# Altium project MB1165.PrjPCB (part 2 of 4)

## Sheet MotorControl.SchDoc: Motor Control
size A4; DocumentNumber: MB1165; Revision: C.1; SheetNumber: 13; SheetTotal: 17; Project: STM32469I-EVAL
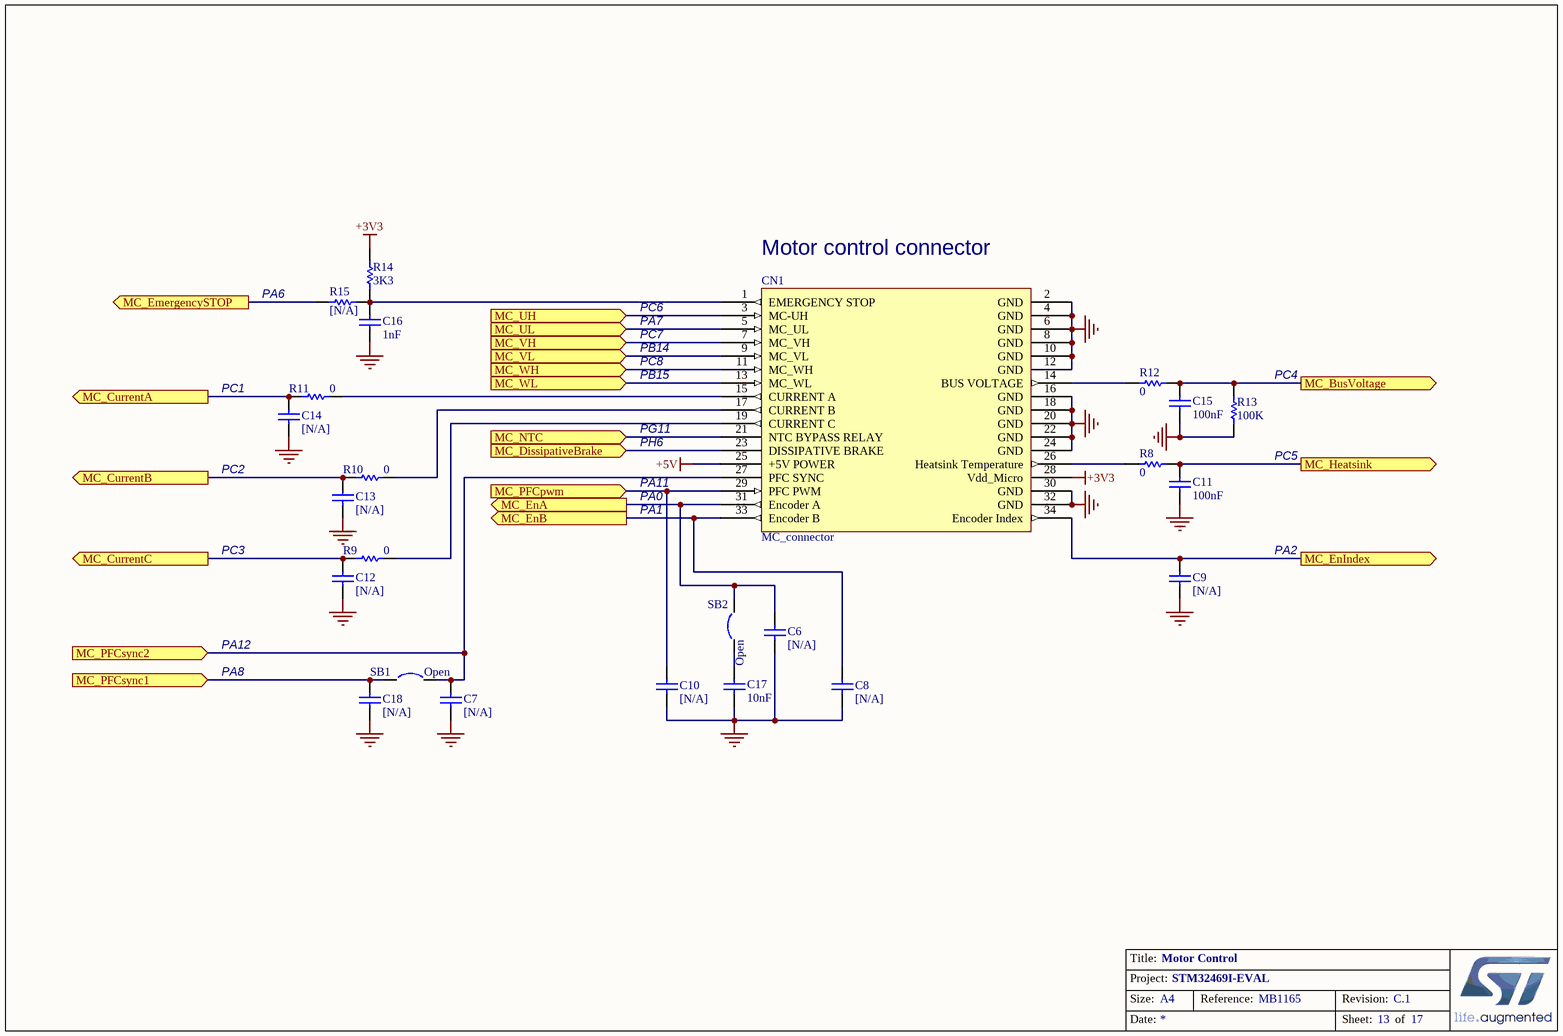
[diagram p7: MotorControl.SchDoc]

### Parts
C6  [N/A]  [0603C]
C7  [N/A]  [0603C]
C8  [N/A]  [0603C]
C9  [N/A]  [0603C]
C10  [N/A]  [0603C]
C11  100nF  [0603C]
C12  [N/A]  [0603C]
C13  [N/A]  [0603C]
C14  [N/A]  [0603C]
C15  100nF  [0603C]
C16  1nF  [0603C]
C17  10nF  [0603C]
C18  [N/A]  [0603C]
CN1  MC_connector  [IDC34S]
R8  0  [0603R]
R9  0  [0603R]
R10  0  [0603R]
R11  0  [0603R]
R12  0  [0603R]
R13  100K  [0603R]
R14  3K3  [0603R]
R15  [N/A]  [0603R]
SB1  Open  [SB_0603]
SB2  Open  [SB_0603]

### Ports
MC_BusVoltage (out), MC_CurrentA (out), MC_CurrentB (out), MC_CurrentC (out), MC_DissipativeBrake (in), MC_EmergencySTOP (out), MC_EnA (out), MC_EnB (out), MC_EnIndex (out), MC_Heatsink (out), MC_NTC (in), MC_PFCpwm (in), MC_PFCsync1 (in), MC_PFCsync2 (in), MC_UH (in), MC_UL (in), MC_VH (in), MC_VL (in), MC_WH (in), MC_WL (in)

### Nets
+3V3: CN1.28(Vdd_Micro) R14.2
+5V: CN1.25(+5V_POWER)
GND: C6.1 C7.1 C8.1 C9.1 C10.1 C11.2 C12.1 C13.1 C14.1 C15.2 C16.1 C17.2 C18.1 CN1.2(GND) CN1.4(GND) CN1.6(GND) CN1.8(GND) CN1.10(GND) CN1.12(GND) CN1.16(GND) CN1.18(GND) CN1.20(GND) CN1.22(GND) CN1.24(GND) CN1.30(GND) CN1.32(GND) R13.2
PA6: R15.2 ; port MC_EmergencySTOP
PAR_D1: CN1.7(MC_VH) ; port MC_VH
NetC6_2: C6.2 CN1.31(Encoder_A) SB2.2 ; port MC_EnA
NetC7_2: C7.2 CN1.27(PFC_SYNC) SB1.2 ; port MC_PFCsync2
NetC8_2: C8.2 CN1.33(Encoder_B) ; port MC_EnB
NetC9_2: C9.2 CN1.34(Encoder_Index) ; port MC_EnIndex
NetC10_2: C10.2 CN1.29(PFC_PWM) ; port MC_PFCpwm
NetC11_1: C11.1 R8.2 ; port MC_Heatsink
NetC12_2: C12.2 R9.1 ; port MC_CurrentC
NetC13_2: C13.2 R10.1 ; port MC_CurrentB
NetC14_2: C14.2 R11.1 ; port MC_CurrentA
NetC15_1: C15.1 R12.2 R13.1 ; port MC_BusVoltage
NetC16_2: C16.2 CN1.1(EMERGENCY_STOP) R14.1 R15.1
NetC17_1: C17.1 SB2.1
NetC18_2: C18.2 SB1.1 ; port MC_PFCsync1
NetCN1_3: CN1.3(MC-UH) ; port MC_UH
NetCN1_5: CN1.5(MC_UL) ; port MC_UL
NetCN1_9: CN1.9(MC_VL) ; port MC_VL
NetCN1_11: CN1.11(MC_WH) ; port MC_WH
NetCN1_13: CN1.13(MC_WL) ; port MC_WL
NetCN1_14: CN1.14(BUS_VOLTAGE) R12.1
NetCN1_15: CN1.15(CURRENT_A) R11.2
NetCN1_17: CN1.17(CURRENT_B) R10.2
NetCN1_19: CN1.19(CURRENT_C) R9.2
NetCN1_21: CN1.21(NTC_BYPASS_RELAY) ; port MC_NTC
NetCN1_23: CN1.23(DISSIPATIVE_BRAKE) ; port MC_DissipativeBrake
NetCN1_26: CN1.26(Heatsink_Temperature) R8.1

### Notes on the sheet
- (near R15) PA6
- PC6
- (near CN1) Motor control connector
- PA7
- PB14
- PB15
- PC7
- PC8
- (near R13) PC4
- PC1
- PG11
- PH6
- PC2
- PA1
- PA0
- PA11
- (near R13) PC5
- PC3
- PA2
- PA12
- PA8
- Title:
- Project:
- Size:
- Date:
- A4
- Reference:
- Sheet:
- Revision:
- of

### Library data of the parts
C6-C10 C12-C14 C18 = cap: Capacitor; Value: 100pF; Published: 8-Jun-2000; Revision: July-2002: Re-released for DXP Platform.; Publisher: Altium Limited
C11 C15 = Cap: Capacitor; Value: 10nF; Published: 8-Jun-2000; Revision: July-2002: Re-released for DXP Platform.; Publisher: Altium Limited
C16 C17 = CAP: Capacitor; Value: 100pF; Published: 8-Jun-2000; Revision: July-2002: Re-released for DXP Platform.; Publisher: Altium Limited
R8-R12 R14 R15 = Res1: Resistor; Value: 1K; Published: 8-Jun-2000; Revision: July-2002: Re-released for DXP Platform.; Publisher: Altium Limited
R13 = res1: Resistor; Value: 1K; Published: 8-Jun-2000; Revision: July-2002: Re-released for DXP Platform.; Publisher: Altium Limited
SB1 SB2 = Circuit Breaker: Published: 24-Mar-1999; Revision: July-2002: Re-released for DXP Platform.; Publisher: Altium Limited

## Sheet Power.SchDoc: Power
size A4; DocumentNumber: MB1165; Revision: C.1; SheetNumber: 3; SheetTotal: 17; Project: STM32469I-EVAL
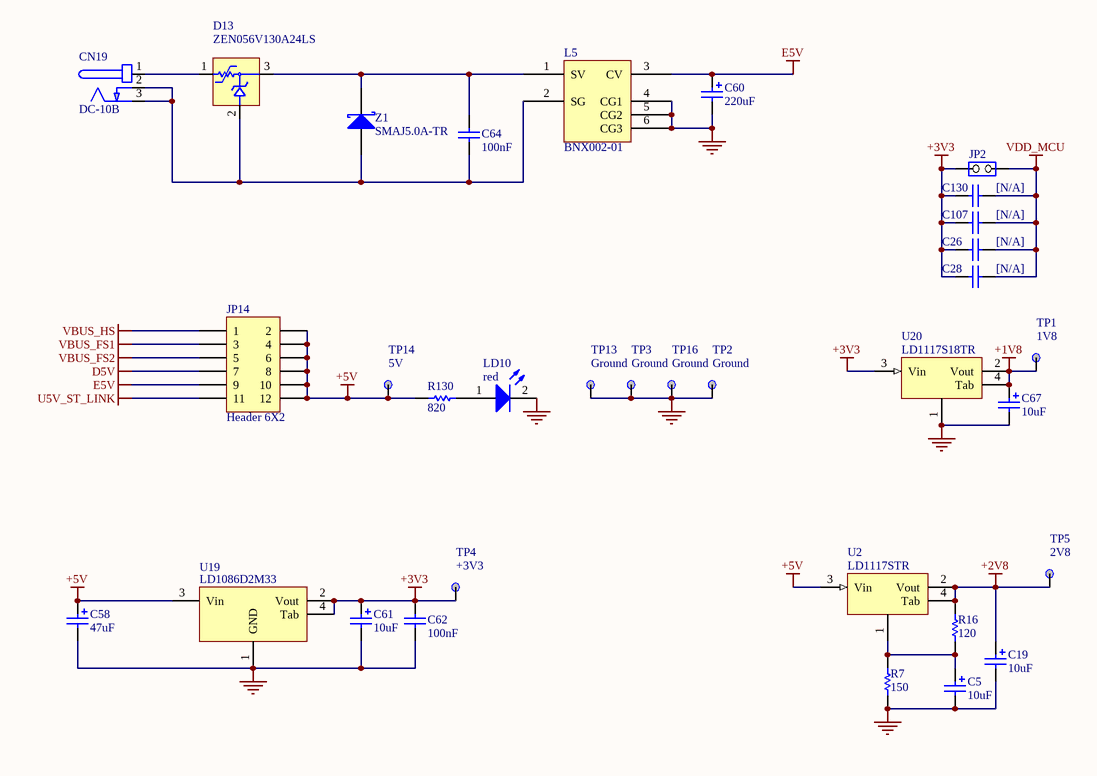
[diagram p8: Power.SchDoc]

### Parts
C5  10uF  [TAN-A]
C19  10uF  [TAN-A]
C26  [N/A]  [0603C]
C28  [N/A]  [0603C]
C58  47uF  [CAE_5R3X5R3_H5R4]
C60  220uF  [c310m-6]
C61  10uF  [TAN-A]
C62  100nF  [0603C]
C64  100nF  [0603C]
C67  10uF  [TAN-A]
C107  [N/A]  [0603C]
C130  [N/A]  [0603C]
CN19  DC-10B  [PWR_JACK_DC10]
D13  ZEN056V130A24LS  [TYCO_ZEN056V130A24LS]
JP2  (no value)  [SIP2]
JP14  Header 6X2  [HDR_2X6_2R54]
L5  BNX002-01  [BNX001]
LD10  red  [0603D]
R7  150  [0603R]
R16  120  [0603R]
R130  820  [0603R]
TP1  1V8  [TP]
TP2  Ground  [TP]
TP3  Ground  [TP]
TP4  +3V3  [TP]
TP5  2V8  [TP]
TP13  Ground  [TP]
TP14  5V  [TP]
TP16  Ground  [TP]
U2  LD1117STR  [SOT-223]
U19  LD1086D2M33  [TO263-3]
U20  LD1117S18TR  [SOT-223]
Z1  SMAJ5.0A-TR  [sma]

### Nets
+1V8: C67.1 TP1.1 U20.2(Vout) U20.4(Tab)
+2V8: C19.1 R16.1 TP5.1 U2.2(Vout) U2.4(Tab)
+3V3: C26.1 C28.1 C61.1 C62.1 C107.1 C130.1 JP2.1(COMMON) TP4.1 U19.2(Vout) U19.4(Tab) U20.3(Vin)
+5V: C58.1 JP14.2 JP14.4 JP14.6 JP14.8 JP14.10 JP14.12 R130.2 TP14.1 U2.3(Vin) U19.3(Vin)
D5V: JP14.7
E5V: C60.1 JP14.9 L5.3(CV)
GND: C5.2 C19.2 C58.2 C60.2 C61.2 C62.2 C67.2 L5.4(CG1) L5.5(CG2) L5.6(CG3) LD10.2(K) R7.2 TP2.1 TP3.1 TP13.1 TP16.1 U19.1(GND) U20.1
U5V_ST_LINK: JP14.11
VBUS_FS1: JP14.3
VBUS_FS2: JP14.5
VBUS_HS: JP14.1
VDD_MCU: C26.2 C28.2 C107.2 C130.2 JP2.2(NO)
NetC5_1: C5.1 R7.1 R16.2 U2.1
NetC64_1: C64.1 D13.3 L5.1(SV) Z1.2(K)
NetC64_2: C64.2 CN19.2(GND) CN19.3(GND) D13.2 L5.2(SG) Z1.1(A)
NetCN19_1: CN19.1(+) D13.1
NetLD10_1: LD10.1(A) R130.1

### Notes on the sheet
- Title:
- Project:
- Size:
- Date:
- A4
- Reference:
- Sheet:
- Revision:
- of

### Library data of the parts
C5 C19 C61 C67 = Cap Pol1: Polarized Capacitor (Radial); Published: 8-Jun-2000; Revision: July-2002: Re-released for DXP Platform.; Publisher: Altium Limited; Value: 10uF
C26 C28 C62 C107 C130 = Cap: Capacitor; Value: 10nF; Published: 8-Jun-2000; Revision: July-2002: Re-released for DXP Platform.; Publisher: Altium Limited
C58 = Cap Pol1: Polarized Capacitor (Radial); Value: 10uF; Published: 8-Jun-2000; Revision: July-2002: Re-released for DXP Platform.; Publisher: Altium Limited
C60 = Cap Pol1: Polarized Capacitor (Radial); Value: 47uF; Published: 8-Jun-2000; Revision: July-2002: Re-released for DXP Platform.; Publisher: Altium Limited
C64 = CAP: Capacitor; Value: 100pF; Published: 8-Jun-2000; Revision: July-2002: Re-released for DXP Platform.; Publisher: Altium Limited
CN19 = PJ202A
JP2 = JP2
JP14 = Header 6X2: Header, 6-Pin, Dual row; Revision: 17-Jul-2002: Re-released for DXP Platform.; Publisher: Altium Limited
L5 = BNX002
LD10 = LED2: Typical RED, GREEN, YELLOW, AMBER GaAs LED; Published: 8-Jun-2000; Revision: July-2002: Re-released for DXP Platform.; Publisher: Altium Limited
R7 R16 R130 = res1: Resistor; Value: 1K; Published: 8-Jun-2000; Revision: July-2002: Re-released for DXP Platform.; Publisher: Altium Limited
TP1-TP5 TP13 TP14 TP16 = TP
U2 U20 = LD1117
U19 = VOLTREG1
Z1 = D Schottky: Schottky Diode; Code - JEDEC: DO-214-AA; Published: 8-Jun-2000; Revision: July-2002: Re-released for DXP Platform.; Publisher: Altium Limited

## Sheet RS232&IrDA.SchDoc: RS232 & IrDA
size A4; DocumentNumber: MB1165; Revision: C.1; SheetNumber: 10; SheetTotal: 17; Project: STM32469I-EVAL
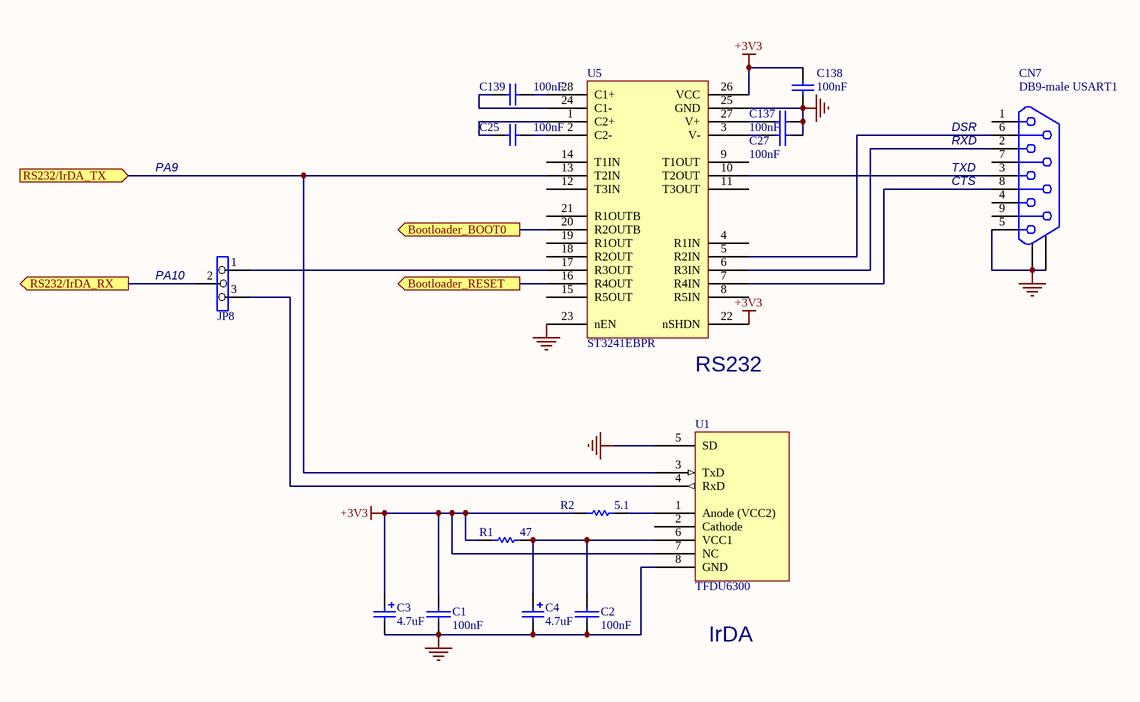
[diagram p9: RS232&IrDA.SchDoc]

### Parts
C1  100nF  [0603C]
C2  100nF  [0603C]
C3  4.7uF  [TAN-A]
C4  4.7uF  [TAN-A]
C25  100nF  [0603C]
C27  100nF  [0603C]
C137  100nF  [0603C]
C138  100nF  [0603C]
C139  100nF  [0603C]
CN7  DB9-male USART1  [DB9/M]
JP8  (no value)  [SIP3]
R1  47  [0603R]
R2  5.1  [0603R]
U1  TFDU6300  [IR_VISHAY3]
U5  ST3241EBPR  [SSOP28_0R65_10R2X7R8]

### Ports
Bootloader_BOOT0 (out), Bootloader_RESET (out), RS232/IrDA_RX (out), RS232/IrDA_TX (in)

### Nets
+3V3: C1.1 C3.1 C138.1 R1.1 R2.1 U1.7(NC) U5.22(nSHDN) U5.26(VCC)
GND: C1.2 C2.2 C3.2 C4.2 C27.1 C137.1 C138.2 CN7.5 CN7.10 CN7.11 U1.5(SD) U1.8(GND) U5.23(nEN) U5.25(GND)
NetC2_1: C2.1 C4.1 R1.2 U1.6(VCC1)
NetC25_1: C25.1 U5.1(C2+)
NetC25_2: C25.2 U5.2(C2-)
NetC27_2: C27.2 U5.3(V-)
NetC137_2: C137.2 U5.27(V+)
NetC139_1: C139.1 U5.24(C1-)
NetC139_2: C139.2 U5.28(C1+)
NetCN7_2: CN7.2 U5.6(R3IN)
NetCN7_3: CN7.3 U5.10(T2OUT)
NetCN7_6: CN7.6 U5.5(R2IN)
NetCN7_8: CN7.8 U5.7(R4IN)
NetD1_1: U5.20(R2OUTB) ; port Bootloader_BOOT0
NetJP4_2: U5.16(R4OUT) ; port Bootloader_RESET
NetJP8_1: JP8.1 U5.17(R3OUT)
NetJP8_2: JP8.2 ; port RS232/IrDA_RX
NetJP8_3: JP8.3 U1.4(RxD)
NetJP19_1: U1.3(TxD) U5.13(T2IN) ; port RS232/IrDA_TX
NetR2_2: R2.2 U1.1(Anode_(VCC2))

Not connected (* = marked no-connect by the designer): CN7 1 4 7 9; U1 2(Cathode); U5 4(R1IN) 8(R5IN) 9(T1OUT) 11(T3OUT) 12(T3IN) 14(T1IN) 15(R5OUT) 18(R2OUT) 19(R1OUT) 21(R1OUTB)

### Notes on the sheet
- PA9
- (near CN7) RXD
- (near CN7) TXD
- (near CN7) DSR
- (near CN7) CTS
- (near JP8) PA10
- (near U5) RS232
- IrDA
- Title:
- Project:
- Size:
- Date:
- A4
- Reference:
- Sheet:
- Revision:
- of

### Library data of the parts
C1 C2 = CAP: Capacitor
C3 C4 = Cap Pol1: Polarized Capacitor (Radial); Value: 100pF; Published: 8-Jun-2000; Revision: July-2002: Re-released for DXP Platform.; Publisher: Altium Limited
C25 C27 C137-C139 = Cap: Capacitor; Value: 10nF; Published: 8-Jun-2000; Revision: July-2002: Re-released for DXP Platform.; Publisher: Altium Limited
CN7 = DB9-USART
JP8 = Jumper3
R1 R2 = Res1: Resistor; Value: 1K; Published: 8-Jun-2000; Revision: July-2002: Re-released for DXP Platform.; Publisher: Altium Limited
U1 = TFDU4300
U5 = ST3241

## Sheet ST_LINK_V2-1.SCHDOC: ST-LINK/V2-1
size A4; DocumentNumber: MB1165; Revision: C.1; SheetNumber: 15; SheetTotal: 17; Project: STM32469I-EVAL
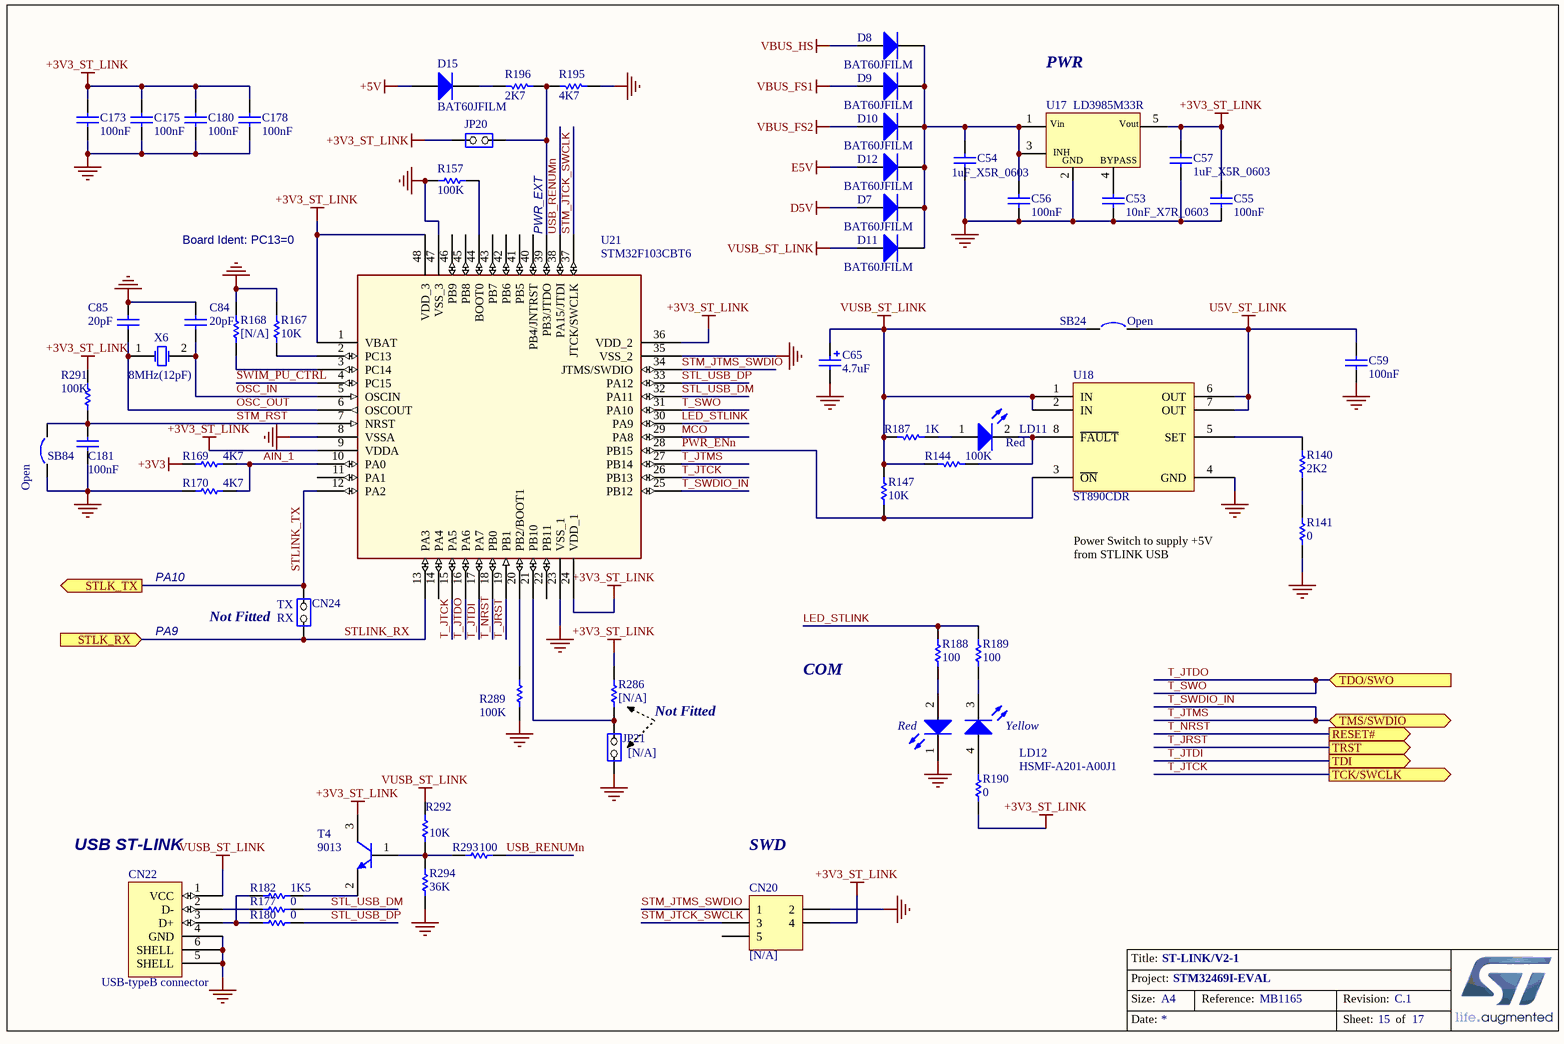
[diagram p10: ST_LINK_V2-1.SCHDOC]

### Parts
C53  10nF_X7R_0603  [0603C]
C54  1uF_X5R_0603  [0603C]
C55  100nF  [0603C]
C56  100nF  [0603C]
C57  1uF_X5R_0603  [0603C]
C59  100nF  [0603C]
C65  4.7uF  [TAN-A]
C84  20pF  [0603C]
C85  20pF  [0603C]
C173  100nF  [0603C]
C175  100nF  [0603C]
C178  100nF  [0603C]
C180  100nF  [0603C]
C181  100nF  [0603C]
CN20  [N/A]  [HDR_2X3-1_2R54-6]
CN22  USB-typeB connector  [USB-B]
CN24  (no value)  [SIP2]
D7  BAT60JFILM  [SOD-323]
D8  BAT60JFILM  [SOD-323]
D9  BAT60JFILM  [SOD-323]
D10  BAT60JFILM  [SOD-323]
D11  BAT60JFILM  [SOD-323]
D12  BAT60JFILM  [SOD-323]
D15  BAT60JFILM  [SOD-323]
JP20  (no value)  [SIP2]
JP21  [N/A]  [SIP2]
LD11  Red  [0603D]
LD12  HSMF-A201-A00J1  [LED2_3528]
R140  2K2  [0402R]
R141  0  [0603R]
R144  100K  [0603R]
R147  10K  [0402R]
R157  100K  [0603R]
R167  10K  [0603R]
R168  [N/A]  [0603R]
R169  4K7  [0603R]
R170  4K7  [0603R]
R177  0  [0603R]
R180  0  [0603R]
R182  1K5  [0603R]
R187  1K  [0603R]
R188  100  [0603R]
R189  100  [0603R]
R190  0  [0603R]
R195  4K7  [0603R]
R196  2K7  [0603R]
R286  [N/A]  [0603R]
R289  100K  [0603R]
R291  100K  [0603R]
R292  10K  [0603R]
R293  100  [0603R]
R294  36K  [0603R]
SB24  Open  [SB_0603]
SB84  Open  [SB_0603]
T4  9013  [SOT-23]
U17  LD3985M33R  [SOT23-5]
U18  ST890CDR  [SOIC8_1R27_4R9X6]
U21  STM32F103CBT6  [LQFP48_0R5_9X9]
X6  8MHz(12pF)  [XTAL_2SM_12R7X4R7]

### Ports
RESET# (out), STLK_RX (in), STLK_TX (out), TCK/SWCLK (out), TDI (out), TDO/SWO (in), TMS/SWDIO (bidir), TRST (out)

### Nets
+3V3: R169.1
+3V3_ST_LINK: C55.2 C57.1 C173.2 C175.2 C178.2 C180.2 CN20.4 JP20.1(COMMON) R190.2 R286.1 R291.2 T4.3(C) U17.5(Vout) U21.1(VBAT) U21.9(VDDA) U21.24(VDD_1) U21.36(VDD_2) U21.48(VDD_3)
+5V: D15.1(A)
D5V: D7.1(A)
E5V: D12.1(A)
GND: C53.1 C54.1 C55.1 C56.1 C57.2 C59.1 C65.2 C84.2 C85.2 C173.1 C175.1 C178.1 C180.1 C181.1 CN20.2 CN22.4(GND) CN22.5(SHELL) CN22.6(SHELL) JP21.1(COMMON) LD12.1(RED_cathode) R141.1 R157.1 R167.1 R168.1 R170.1 R195.2 R289.1 R294.1 SB84.1 U17.2(GND) U18.4(GND) U21.8(VSSA) U21.23(VSS_1) U21.35(VSS_2) U21.47(VSS_3)
U5V_ST_LINK: C59.2 SB24.2 U18.6(OUT) U18.7(OUT)
VBUS_FS1: D9.1(A)
VBUS_FS2: D10.1(A)
VBUS_HS: D8.1(A)
VUSB_ST_LINK: C65.1 CN22.1(VCC) D11.1(A) R144.1 R147.1 R187.1 R292.2 SB24.1 U18.1(IN) U18.2(IN)
AIN_1: R169.2 R170.2 U21.10(PA0)
LED_STLINK: R188.1 R189.1 U21.30(PA9)
MCO: U21.29(PA8)
OSC_IN: C84.1 U21.5(OSCIN) X6.2(OSC2)
OSC_OUT: C85.1 U21.6(OSCOUT) X6.1(OSC1)
PWR_ENn: R147.2 U18.3(~{ON}) U21.28(PB15)
STL_USB_DM: R177.2 U21.32(PA11)
STL_USB_DP: R180.2 U21.33(PA12)
STLINK_RX: CN24.1(COMMON) U21.13(PA3) ; port STLK_RX
STLINK_TX: CN24.2(NO) U21.12(PA2) ; port STLK_TX
STM_JTCK_SWCLK: CN20.3 U21.37(JTCK/SWCLK)
STM_JTMS_SWDIO: CN20.1 U21.34(JTMS/SWDIO)
STM_RST: C181.2 R291.1 SB84.2 U21.7(NRST)
SWIM_PU_CTRL: U21.4(PC15)
T_JRST: U21.19(PB1) ; port TRST  [project net PB4]
T_JTCK: U21.15(PA5) U21.26(PB13) ; port TCK/SWCLK  [project net PA14]
T_JTDI: U21.17(PA7) ; port TDI  [project net PA15]
T_JTDO: U21.16(PA6) U21.31(PA10) ; port TDO/SWO  [also labelled T_SWO]
T_JTMS: U21.25(PB12) U21.27(PB14) ; port TMS/SWDIO  [also labelled T_SWDIO_IN]  [project net PA13]
T_NRST: U21.18(PB0) ; port RESET#  [project net RESET#]
USB_RENUMn: R293.2 U21.38(PA15/JTDI)
NetC53_2: C53.2 U17.4(BYPASS)
NetC54_2: C54.2 C56.2 D7.2(K) D8.2(K) D9.2(K) D10.2(K) D11.2(K) D12.2(K) U17.1(Vin) U17.3(CE)
NetCN22_2: CN22.2(D-) R177.1
NetCN22_3: CN22.3(D+) R180.1 R182.1
NetD15_2: D15.2(K) R196.1
NetJP20_2: JP20.2(NO) R195.1 R196.2 U21.39(PB3/JTDO)
NetJP21_2: JP21.2(NO) R286.2 U21.21(PB10)
NetLD11_1: LD11.1(A) R187.2
NetLD11_2: LD11.2(K) R144.2 U18.8(~{FAULT})
NetLD12_2: LD12.2(Red_anode) R188.2
NetLD12_3: LD12.3(YellowGreen_cathode) R189.2
NetLD12_4: LD12.4(YellowGreen_anode) R190.1
NetR140_1: R140.1 R141.2
NetR140_2: R140.2 U18.5(SET)
NetR157_2: R157.2 U21.44(BOOT0)
NetR167_2: R167.2 U21.2(PC13)
NetR168_2: R168.2 U21.3(PC14)
NetR182_2: R182.2 T4.2(E)
NetR289_2: R289.2 U21.20(PB2/BOOT1)
NetR292_1: R292.1 R293.1 R294.2 T4.1(B)

Not connected (* = marked no-connect by the designer): CN20 5; U21 11(PA1) 14(PA4) 22(PB11) 40(PB4/JNTRST) 41(PB5) 42(PB6) 43(PB7) 45(PB8) 46(PB9)

### Notes on the sheet
- PWR
- Board Ident: PC13=0
- (near U21) PWR_EXT
- PA10
- Power Switch to supply +5V from STLINK USB
- PA9
- (near CN24) Not Fitted
- (near CN24) TX
- (near CN24) RX
- Not Fitted
- COM
- (near CN22) USB ST-LINK
- SWD
- Title:
- Project:
- Size:
- Date:
- A4
- Reference:
- Sheet:
- Revision:
- of
- (in symbol HSMF-A201-A00J1) Red; Yellow
- (in symbol LD3985M33R) INH

### Library data of the parts
C53 = CAP SMD 0603  X7R 10000PF 50V 10%: 0603  X7R 10NF; Order code RS: 2040779; Rated voltage: 50V; Tolerance: 10%; Order code Farnell: 7569548RL; Value: 10NF; Power: *; Technology: X7R; Temperature Factor: *; Temperature Min: -55°C; Temperature Max: +125°C; STS Code: *
C54 C57 = CAP SMD 0603  X5R 1µF 25V 10%: 0603  X5R 1µF; Rated voltage: 25V; Tolerance: 10%; Manufacturer: *; Manufacturer P/N: *; Order code Farnell: 1288202RL; Value: 1µF; Power: *; Technology: X5R; Temperature  Factor: *; Temperature Max: +125°C; Temperature Min: -55°C; STS Code: *
C55 C56 C59 C173 C175 C178 C180 C181 = Capacitor_ST: Capacitor 0402 / 0603 / 0805; Revision: July-2002: Re-released for DXP Platform.; Value: 100nF
C65 = Cap Pol1: Polarized Capacitor (Radial); Value: 100pF; Ordered by: Subcon; Published: 8-Jun-2000; Revision: July-2002: Re-released for DXP Platform.; Publisher: Altium Limited
C84 C85 = Capacitor_ST: Capacitor 0402 / 0603 / 0805; Value: 100nF; Revision: July-2002: Re-released for DXP Platform.
CN20 = Header 3X2: Header, 3-Pin, Dual row; Revision: 17-Jul-2002: Re-released for DXP Platform.; Publisher: Altium Limited
CN24 = JP2: Fitted: NO
D7-D12 = BAT60JFILM: Manuf_1: STM; Provided: ST; ECCN_US/EU: EAR99/NEC; Revision: July-2002: Re-released for DXP Platform.; Order: BAT60JFILM; Manuf_Part_1: BAT60JFILM; Distrib: ST
D15 = Diode: Default Diode; Code - JEDEC: DO-214-AB; Ordered by: STM; ECCN_US/EU: EAR99/NEC; Published: 8-Jun-2000; Revision: July-2002: Re-released for DXP Platform.; Publisher: Altium Limited
JP20 = JP2: Ordered by: Subcon; Silkscreen: Pwr_ext
JP21 = JP2
LD11 = LED2: Typical RED, GREEN, YELLOW, AMBER GaAs LED; Published: 8-Jun-2000; Revision: July-2002: Re-released for DXP Platform.; Publisher: Altium Limited
R140 R157 R177 R180 R182 R289 R291 R293 = Resistor_ST: Resistor 0402 / 0603 / 0805; Description: Resistor 0402 or 0603 or 0805; Value: 10K
R141 R188-R190 R195 R196 R286 R292 R294 = Res1: Resistor; Value: 1K; Published: 8-Jun-2000; Revision: July-2002: Re-released for DXP Platform.; Publisher: Altium Limited
R144 = Res1: Resistor; Value: 1K; Ordered by: Subcon; Published: 8-Jun-2000; Revision: July-2002: Re-released for DXP Platform.; Publisher: Altium Limited
R147 R167 = Resistor_ST: Resistor 0402 / 0603 / 0805; Description: Resistor 0402 or 0603 or 0805; Value: 10K
R168-R170 = Resistor_ST: Resistor 0402 / 0603 / 0805; Description: Resistor 0402 or 0603 or 0805; Value: 10K; Fitted: NO
R187 = Res1: Resistor; Ordered by: Subcon; Published: 8-Jun-2000; Revision: July-2002: Re-released for DXP Platform.; Publisher: Altium Limited; Value: 1K
SB24 SB84 = Circuit Breaker: Published: 24-Mar-1999; Revision: July-2002: Re-released for DXP Platform.; Publisher: Altium Limited
T4 = NPN: NPN Bipolar Transistor; Code - JEDEC: TO-226-AA; Published: 8-Jun-2000; Revision: July-2002: Re-released for DXP Platform.; Publisher: Altium Limited
U17 = LD3985M33R: Ultra low drop-low noise BiCMOS voltage, regulators low ESR capacitors compatible; Manuf_1: STM; Provided: ST; Ref St: 9176161; ECCN_US/EU: EAR99/NEC; Manuf_Part_1: LD3985M33R; Distrib: ST; Order: LD3985M33R
U21 = STM32F103CBT6: Medium-density performance line ARM-based 32-bit MCU with 64KB Flash; Manuf_Part_1: STM32F103C8T6; Manuf_1: STM; Ref St: 9175981; Provided: ST; ECCN_US/EU: 3A991A2/NEC; Footprint: QFP48 7X7; Distrib: ST; Order: STM32F103C8T6
X6 = XTAL: Crystal Oscillator; Published: 8-Jun-2000; LatestRevisionDate: 17-Jul-2002; LatestRevisionNote: Re-released for DXP Platform.; PackageReference: R38; Publisher: Altium Limited

## Sheet USB_OTG.SchDoc: USB_OTG_HS
size A4; DocumentNumber: MB1165; Revision: C.1; SheetNumber: 8; SheetTotal: 17; Project: STM32469I-EVAL
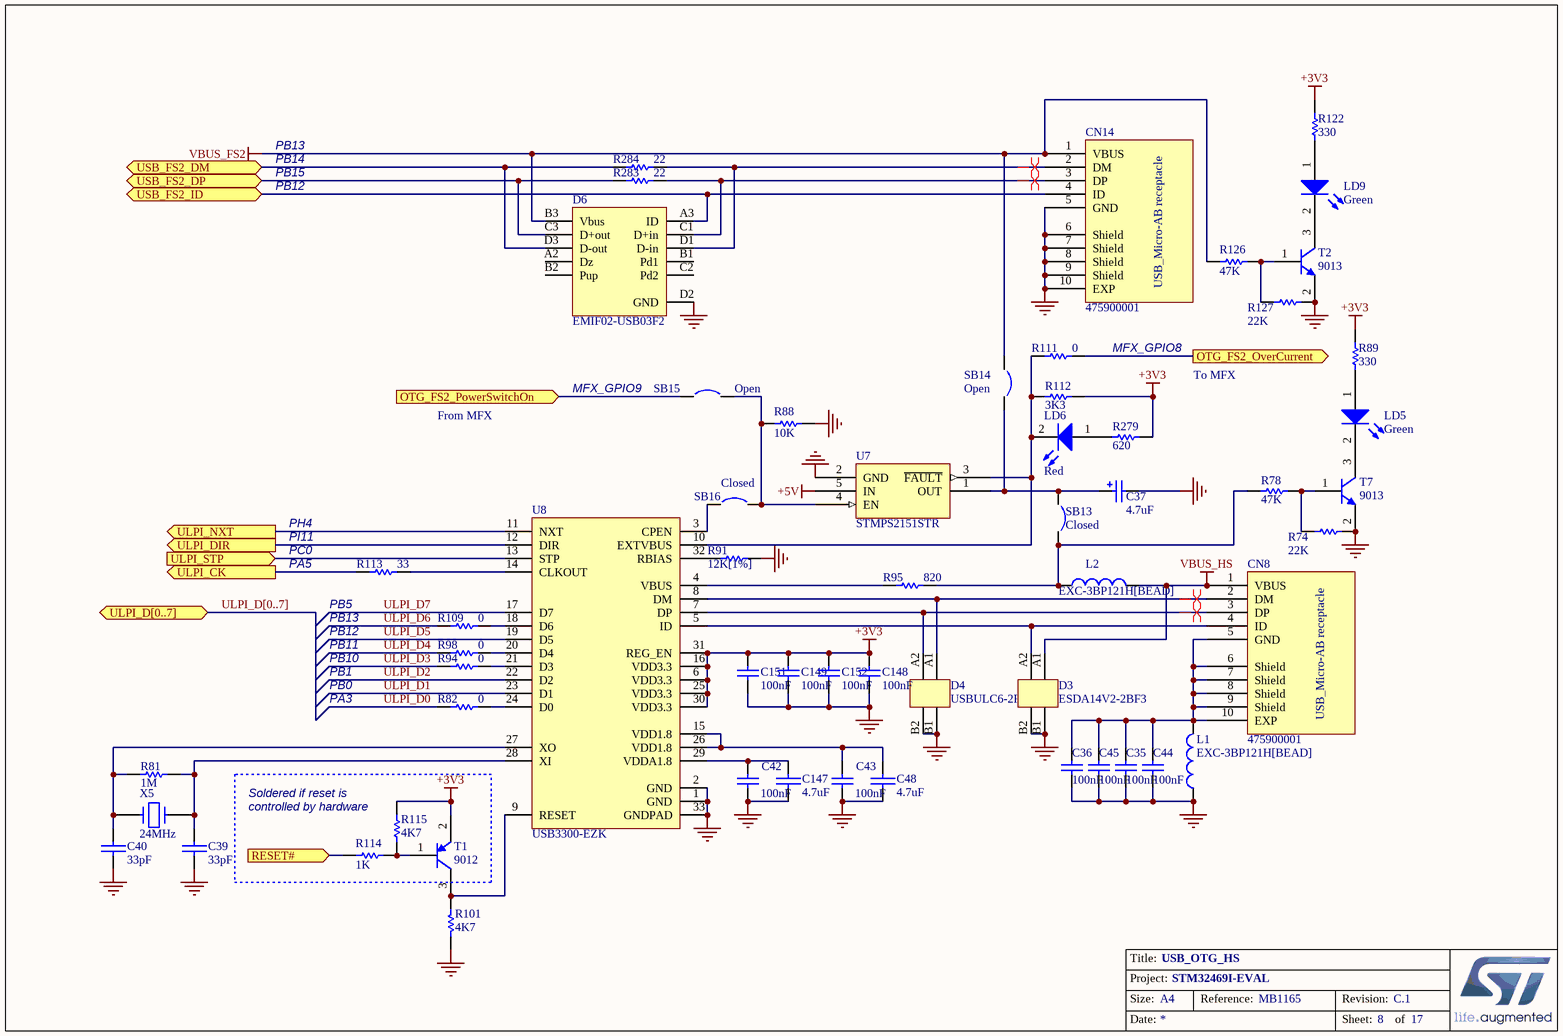
[diagram p11: USB_OTG.SchDoc]

### Parts
C35  100nF  [0603C]
C36  100nF  [0603C]
C37  4.7uF  [TAN-A]
C39  33pF  [0603C]
C40  33pF  [0603C]
C42  100nF  [0603C]
C43  100nF  [0603C]
C44  100nF  [0603C]
C45  100nF  [0603C]
C48  4.7uF  [TAN-A]
C147  4.7uF  [TAN-A]
C148  100nF  [0603C]
C149  100nF  [0603C]
C151  100nF  [0603C]
C152  100nF  [0603C]
CN8  475900001  [MOLEX_47590001]
CN14  475900001  [MOLEX_47590001]
D3  ESDA14V2-2BF3  [BGA4_0R4_0R8X0R8]
D4  USBULC6-2F3  [BGA4_0R4_1X1]
D6  EMIF02-USB03F2  [BGA11_0R5_1R57X2R07]
L1  EXC-3BP121H[BEAD]  [0603L]
L2  EXC-3BP121H[BEAD]  [0603L]
LD5  Green  [0603D]
LD6  Red  [0603D]
LD9  Green  [0603D]
R74  22K  [0603R]
R78  47K  [0603R]
R81  1M  [0603R]
R82  0  [0603R]
R88  10K  [0603R]
R89  330  [0603R]
R91  12K[1%]  [0603R]
R94  0  [0603R]
R95  820  [0603R]
R98  0  [0603R]
R101  4K7  [0603R]
R109  0  [0603R]
R111  0  [0603R]
R112  3K3  [0603R]
R113  33  [0603R]
R114  1K  [0603R]
R115  4K7  [0603R]
R122  330  [0603R]
R126  47K  [0603R]
R127  22K  [0603R]
R279  620  [0603R]
R283  22  [0603R]
R284  22  [0603R]
SB13  Closed  [SB_0603]
SB14  Open  [SB_0603]
SB15  Open  [SB_0603]
SB16  Closed  [SB_0603]
T1  9012  [SOT-23]
T2  9013  [SOT-23]
T7  9013  [SOT-23]
U7  STMPS2151STR  [SOT23-5]
U8  USB3300-EZK  [QFN32_0R5_5X5]
X5  24MHz  [XTAL1]

### Ports
OTG_FS2_OverCurrent (out), OTG_FS2_PowerSwitchOn (in), RESET# (in), ULPI_CK (out), ULPI_D[0..7] (bidir), ULPI_DIR (out), ULPI_NXT (out), ULPI_STP (in), USB_FS2_DM (bidir), USB_FS2_DP (bidir), USB_FS2_ID (bidir)

### Nets
+3V3: C148.1 C149.1 C151.1 C152.1 R89.2 R112.1 R115.1 R122.2 R279.2 T1.2(E) U8.6(VDD3.3) U8.16(VDD3.3) U8.25(VDD3.3) U8.30(VDD3.3) U8.31(REG_EN)
+5V: U7.5(IN)
GND: C35.2 C36.2 C37.2 C39.2 C40.2 C42.2 C43.2 C44.2 C45.2 C48.2 C147.2 C148.2 C149.2 C151.2 C152.2 CN14.5(GND) CN14.6(Shield) CN14.7(Shield) CN14.8(Shield) CN14.9(Shield) CN14.10(EXP) D3.B1 D3.B2 D4.B1 D4.B2 D6.D2(GND) L1.1 R74.1 R88.1 R91.1 R101.1 R127.1 T2.2(E) T7.2(E) U7.2(GND) U8.1(GND) U8.2(GND) U8.33(GNDPAD)
VBUS_FS2: CN14.1(VBUS) D6.B3(Vbus) R126.1 SB14.1
VBUS_HS: CN8.1(VBUS) D3.A1 L2.2
PA5: R113.2 ; port ULPI_CK
RESET#: R114.2 ; port RESET#
ULPI_D0: R82.2  [project net PA3]
ULPI_D1: U8.23(D1)
ULPI_D2: U8.22(D2)
ULPI_D3: R94.2  [project net PB10]
ULPI_D4: R98.2  [project net PB11]
ULPI_D5: U8.19(D5)
ULPI_D6: R109.2  [project net PB13]
ULPI_D7: U8.17(D7)
NetC35_1: C35.1 C36.1 C44.1 C45.1 CN8.5(GND) CN8.6(Shield) CN8.7(Shield) CN8.8(Shield) CN8.9(Shield) CN8.10(EXP) L1.2
NetC37_1: C37.1 SB13.1 SB14.2 U7.1(OUT)
NetC39_1: C39.1 R81.2 U8.28(XI) X5.1
NetC40_1: C40.1 R81.1 U8.27(XO) X5.2
NetC42_1: C42.1 C147.1 U8.29(VDDA1.8)
NetC43_1: C43.1 C48.1 U8.15(VDD1.8) U8.26(VDD1.8)
NetCN8_2: CN8.2(DM) D4.A1 U8.8(DM)
NetCN8_3: CN8.3(DP) D4.A2 U8.7(DP)
NetCN8_4: CN8.4(ID) D3.A2 U8.5(ID)
NetCN14_2: CN14.2(DM) D6.D1(D-in) R284.1
NetCN14_3: CN14.3(DP) D6.C1(D+in) R283.1
NetCN14_4: CN14.4(ID) D6.A3(ID) ; port USB_FS2_ID
NetD6_C3: D6.C3(D+out) R283.2 ; port USB_FS2_DP
NetD6_D3: D6.D3(D-out) R284.2 ; port USB_FS2_DM
NetL2_1: L2.1 R78.2 R95.2 SB13.2
NetLD5_1: LD5.1(A) R89.1
NetLD5_2: LD5.2(K) T7.3(C)
NetLD6_1: LD6.1(A) R279.1
NetLD6_2: LD6.2(K) R111.2 R112.2 U7.3(~{FAULT}) U8.10(EXTVBUS)
NetLD9_1: LD9.1(A) R122.1
NetLD9_2: LD9.2(K) T2.3(C)
NetR74_2: R74.2 R78.1 T7.1(B)
NetR82_1: R82.1 U8.24(D0)
NetR88_2: R88.2 SB15.2 SB16.2 U7.4(EN)
NetR91_2: R91.2 U8.32(RBIAS)
NetR94_1: R94.1 U8.21(D3)
NetR95_1: R95.1 U8.4(VBUS)
NetR98_1: R98.1 U8.20(D4)
NetR101_2: R101.2 T1.3(C) U8.9(RESET)
NetR109_1: R109.1 U8.18(D6)
NetR111_1: R111.1 ; port OTG_FS2_OverCurrent
NetR113_1: R113.1 U8.14(CLKOUT)
NetR114_1: R114.1 R115.2 T1.1(B)
NetR126_2: R126.2 R127.2 T2.1(B)
NetSB15_1: SB15.1 ; port OTG_FS2_PowerSwitchOn
NetSB16_1: SB16.1 U8.3(CPEN)
NetSB32_2: U8.12(DIR) ; port ULPI_DIR
NetSB34_2: U8.13(STP) ; port ULPI_STP
NetSB56_2: U8.11(NXT) ; port ULPI_NXT

Not connected (* = marked no-connect by the designer): D6 A2(Dz) B1(Pd1) B2(Pup) C2(Pd2)

### Buses and harness runs
bus ULPI_D[0..7] = port ULPI_D[0..7]

### Layout directives
differential pair: NetCN8_2, NetCN8_3, NetCN14_2, NetCN14_3

### Notes on the sheet
- PB13
- PB14
- PB15
- PB12
- MFX_GPIO8
- To MFX
- From MFX
- MFX_GPIO9
- PH4
- PI11
- PC0
- PA5
- PB11
- (near R113) PB13
- (near R113) PB5
- PA3
- PB0
- PB1
- PB10
- (near R115) Soldered if reset is
- (near R115) controlled by hardware
- Title:
- Project:
- Size:
- Date:
- A4
- Reference:
- Sheet:
- Revision:
- of
- (in symbol 475900001) USB_Micro-AB receptacle

### Library data of the parts
C35 C36 C42-C45 C148 C149 C151 C152 = Cap: Capacitor; Value: 10nF; Published: 8-Jun-2000; Revision: July-2002: Re-released for DXP Platform.; Publisher: Altium Limited
C37 = Cap Pol1: Polarized Capacitor (Radial); Value: 47uF; Published: 8-Jun-2000; Revision: July-2002: Re-released for DXP Platform.; Publisher: Altium Limited
C39 C40 C48 C147 = CAP: Capacitor
L1 L2 = Inductor: Value: 100uH; Published: 8-Jun-2000; Revision: July-2002: Re-released for DXP Platform.; Publisher: Altium Limited
LD5 LD6 LD9 = LED2: as LD11 on sheet ST_LINK_V2-1; Published: 8-Jun-2000; Revision: July-2002: Re-released for DXP Platform.; Publisher: Altium Limited
R74 R78 R88 R89 R95 R112 R122 R126 R127 = res1: Resistor; Value: 1K; Published: 8-Jun-2000; Revision: July-2002: Re-released for DXP Platform.; Publisher: Altium Limited
R81 R82 R91 R94 R98 R101 R109 R111 R113 R115 R279 R283 R284 = Res1: Resistor; Value: 1K; Published: 8-Jun-2000; Revision: July-2002: Re-released for DXP Platform.; Publisher: Altium Limited
R114 = Res1: Resistor; Published: 8-Jun-2000; Revision: July-2002: Re-released for DXP Platform.; Publisher: Altium Limited; Value: 1K
SB13 SB16 = Circuit Breaker_close: Circuit Breaker; Published: 24-Mar-1999; Revision: July-2002: Re-released for DXP Platform.; Publisher: Altium Limited
SB14 SB15 = Circuit Breaker: Published: 24-Mar-1999; Revision: July-2002: Re-released for DXP Platform.; Publisher: Altium Limited
T1 = PNP: PNP Bipolar Transistor; Published: 8-Jun-2000; Revision: July-2002: Re-released for DXP Platform.; Publisher: Altium Limited; Code - JEDEC: SOT-23
T2 T7 = NPN: as T4 on sheet ST_LINK_V2-1; Published: 8-Jun-2000; Revision: July-2002: Re-released for DXP Platform.; Publisher: Altium Limited
U7 = STMPS2141STR
X5 = CRYSTAL

## Sheet USB_OTG_FS.SchDoc: USB_OTG_FS
size A4; DocumentNumber: MB1165; Revision: C.1; SheetNumber: 9; SheetTotal: 17; Project: STM32469I-EVAL
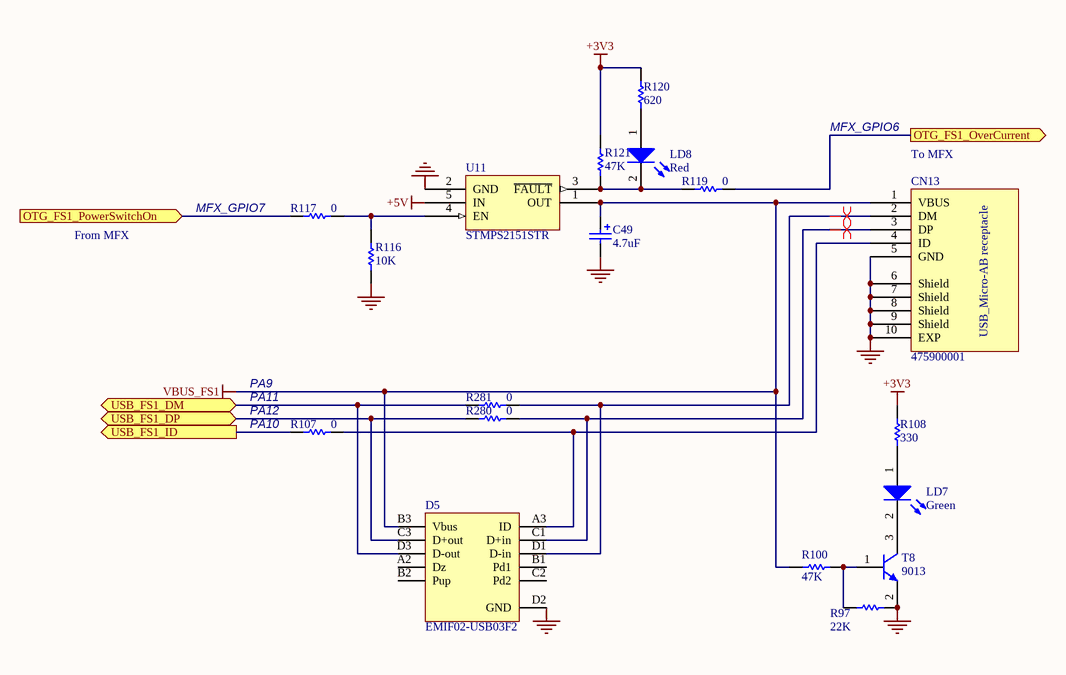
[diagram p12: USB_OTG_FS.SchDoc]

### Parts
C49  4.7uF  [TAN-A]
CN13  475900001  [MOLEX_47590001]
D5  EMIF02-USB03F2  [BGA11_0R5_1R57X2R07]
LD7  Green  [0603D]
LD8  Red  [0603D]
R97  22K  [0603R]
R100  47K  [0603R]
R107  0  [0603R]
R108  330  [0603R]
R116  10K  [0603R]
R117  0  [0603R]
R119  0  [0603R]
R120  620  [0603R]
R121  47K  [0603R]
R280  0  [0603R]
R281  0  [0603R]
T8  9013  [SOT-23]
U11  STMPS2151STR  [SOT23-5]

### Ports
OTG_FS1_OverCurrent (out), OTG_FS1_PowerSwitchOn (in), USB_FS1_DM (bidir), USB_FS1_DP (bidir), USB_FS1_ID (out)

### Nets
+3V3: R108.2 R120.2 R121.1
+5V: U11.5(IN)
GND: C49.2 CN13.5(GND) CN13.6(Shield) CN13.7(Shield) CN13.8(Shield) CN13.9(Shield) CN13.10(EXP) D5.D2(GND) R97.1 R116.1 T8.2(E) U11.2(GND)
VBUS_FS1: C49.1 CN13.1(VBUS) D5.B3(Vbus) R100.1 U11.1(OUT)
PA10: R107.2 ; port USB_FS1_ID
PA11: D5.D3(D-out) R281.2 ; port USB_FS1_DM
NetCN13_2: CN13.2(DM) D5.D1(D-in) R281.1
NetCN13_3: CN13.3(DP) D5.C1(D+in) R280.1
NetCN13_4: CN13.4(ID) D5.A3(ID) R107.1
NetD5_C3: D5.C3(D+out) R280.2 ; port USB_FS1_DP
NetLD7_1: LD7.1(A) R108.1
NetLD7_2: LD7.2(K) T8.3(C)
NetLD8_1: LD8.1(A) R120.1
NetLD8_2: LD8.2(K) R119.2 R121.2 U11.3(~{FAULT})
NetR97_2: R97.2 R100.2 T8.1(B)
NetR116_2: R116.2 R117.1 U11.4(EN)
NetR117_2: R117.2 ; port OTG_FS1_PowerSwitchOn
NetR119_1: R119.1 ; port OTG_FS1_OverCurrent

Not connected (* = marked no-connect by the designer): D5 A2(Dz) B1(Pd1) B2(Pup) C2(Pd2)

### Layout directives
differential pair: NetCN13_2, NetCN13_3

### Notes on the sheet
- MFX_GPIO6
- (near R117) MFX_GPIO7
- (near CN13) To MFX
- From MFX
- PA9
- (near R107) PA11
- (near R107) PA12
- (near R107) PA10
- Title:
- Project:
- Size:
- Date:
- A4
- Reference:
- Sheet:
- Revision:
- of
- (in symbol 475900001) USB_Micro-AB receptacle

### Library data of the parts
C49 = Cap Pol1: as C37 on sheet USB_OTG; Published: 8-Jun-2000; Revision: July-2002: Re-released for DXP Platform.; Publisher: Altium Limited
LD7 LD8 = LED2: as LD11 on sheet ST_LINK_V2-1; Published: 8-Jun-2000; Revision: July-2002: Re-released for DXP Platform.; Publisher: Altium Limited
R97 R100 R108 R121 = res1: Resistor; Value: 1K; Published: 8-Jun-2000; Revision: July-2002: Re-released for DXP Platform.; Publisher: Altium Limited
R107 R116 R117 R119 R120 R280 R281 = Res1: Resistor; Value: 1K; Published: 8-Jun-2000; Revision: July-2002: Re-released for DXP Platform.; Publisher: Altium Limited
T8 = NPN: as T4 on sheet ST_LINK_V2-1; Published: 8-Jun-2000; Revision: July-2002: Re-released for DXP Platform.; Publisher: Altium Limited
U11 = STMPS2141STR

## Sheet MFX.SchDoc: MFX
size A4; DocumentNumber: MB1165; Revision: C.1; SheetNumber: 16; SheetTotal: 17; Project: STM32469I-EVAL
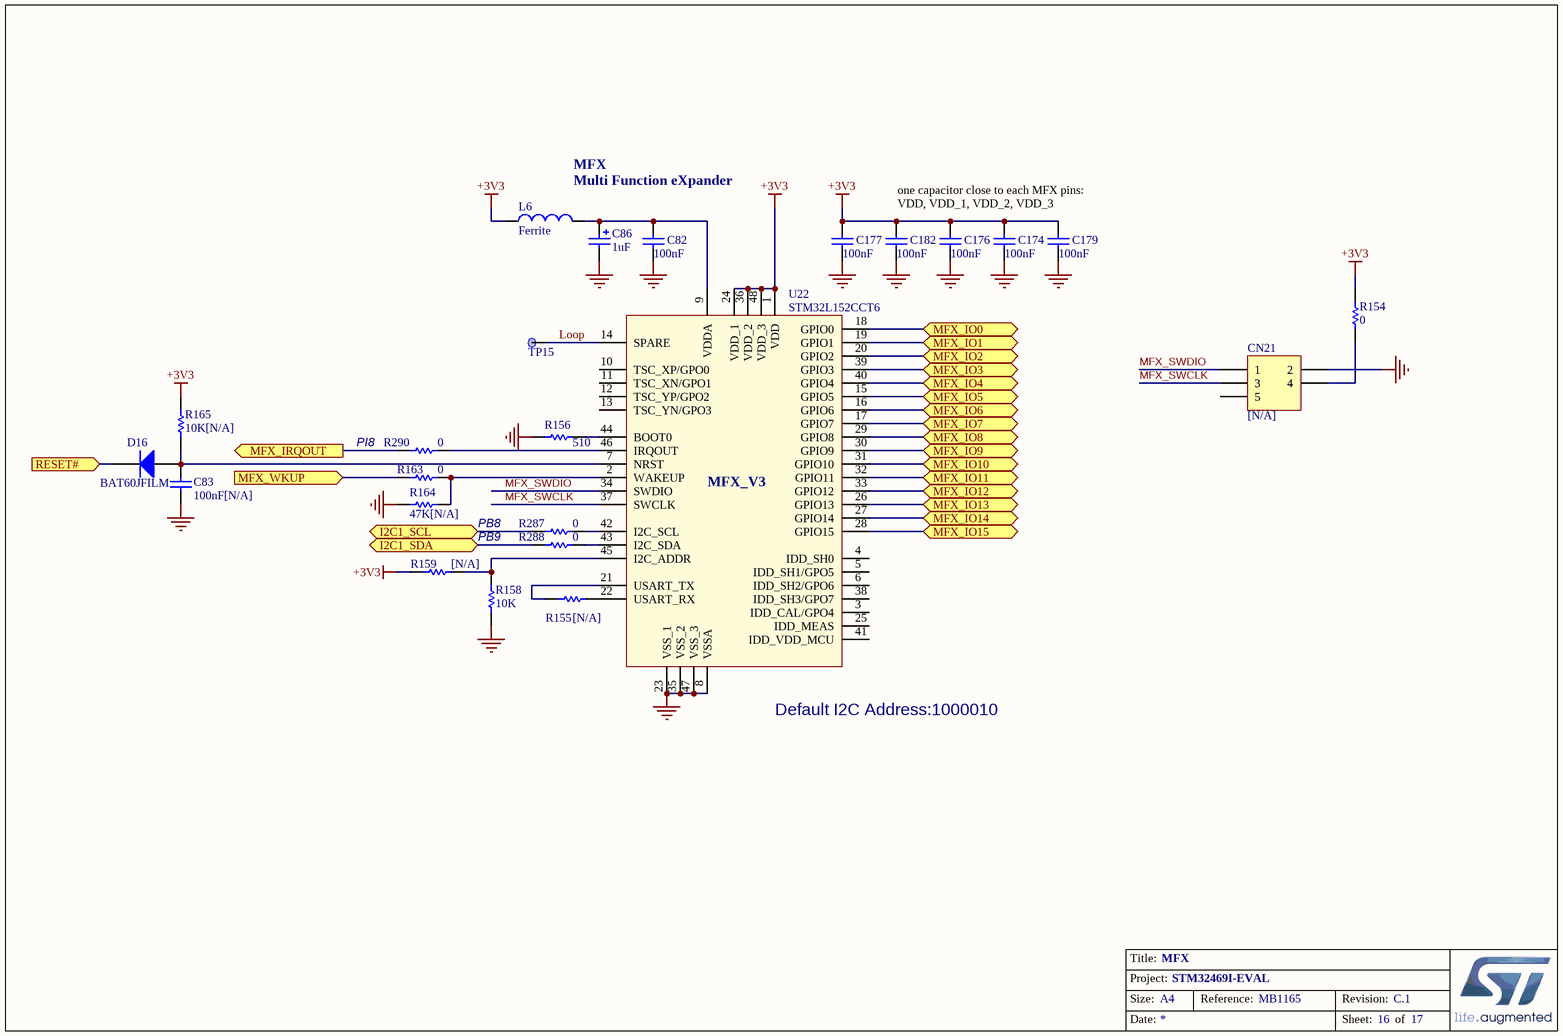
[diagram p13: MFX.SchDoc]

### Parts
C82  100nF  [0402C]
C83  100nF[N/A]  [0402C]
C86  1uF  [TAN-A]
C174  100nF  [0402C]
C176  100nF  [0402C]
C177  100nF  [0402C]
C179  100nF  [0402C]
C182  100nF  [0402C]
CN21  [N/A]  [HDR_2X3-1_2R54-6]
D16  BAT60JFILM  [SOD-323]
L6  Ferrite  [0603L]
R154  0  [0603R]
R155  [N/A]  [0603R]
R156  510  [0402R]
R158  10K  [0402R]
R159  [N/A]  [0603R]
R163  0  [0603R]
R164  47K[N/A]  [0402R]
R165  10K[N/A]  [0402R]
R287  0  [0603R]
R288  0  [0603R]
R290  0  [0603R]
TP15  (no value)  [TP]
U22  STM32L152CCT6  [LQFP48_0R5_9X9]

### Ports
I2C1_SCL (bidir), I2C1_SDA (bidir), MFX_IO0 (bidir), MFX_IO1 (bidir), MFX_IO2 (bidir), MFX_IO3 (bidir), MFX_IO4 (bidir), MFX_IO5 (bidir), MFX_IO6 (bidir), MFX_IO7 (bidir), MFX_IO8 (bidir), MFX_IO9 (bidir), MFX_IO10 (bidir), MFX_IO11 (bidir), MFX_IO12 (bidir), MFX_IO13 (bidir), MFX_IO14 (bidir), MFX_IO15 (bidir), MFX_IRQOUT (out), MFX_WKUP (in), RESET# (in)

### Nets
+3V3: C174.2 C176.1 C177.2 C179.2 C182.2 L6.1 R154.1 R159.2 R165.2 U22.1(VDD) U22.24(VDD_1) U22.36(VDD_2) U22.48(VDD_3)
GND: C82.1 C83.1 C86.2 C174.1 C176.2 C177.1 C179.1 C182.1 CN21.2 R156.2 R158.2 R164.1 U22.8(VSSA) U22.23(VSS_1) U22.35(VSS_2) U22.47(VSS_3)
I2C1_SCL: R287.1 ; port I2C1_SCL
I2C1_SDA: R288.1 ; port I2C1_SDA
Loop: TP15.1 U22.14(SPARE)
MFX_SWCLK: CN21.3 U22.37(SWCLK)
MFX_SWDIO: CN21.1 U22.34(SWDIO)
PI8: R290.1 ; port MFX_IRQOUT
RESET#: D16.2(K) ; port RESET#
TOUCH_INT: U22.27(GPIO14) ; port MFX_IO14
NetB4_1: U22.20(GPIO2) ; port MFX_IO2
NetB4_2: U22.18(GPIO0) ; port MFX_IO0
NetB4_3: U22.19(GPIO1) ; port MFX_IO1
NetB4_4: U22.39(GPIO3) ; port MFX_IO3
NetB4_6: U22.40(GPIO4) ; port MFX_IO4
NetC82_2: C82.2 C86.1 L6.2 U22.9(VDDA)
NetC83_2: C83.2 D16.1(A) R165.1 U22.7(NRST)
NetCN4_15: U22.33(GPIO12) ; port MFX_IO12
NetCN4_17: U22.32(GPIO11) ; port MFX_IO11
NetCN4_19: U22.31(GPIO10) ; port MFX_IO10
NetCN21_4: CN21.4 R154.2
NetR68_2: U22.26(GPIO13) ; port MFX_IO13
NetR111_1: U22.29(GPIO8) ; port MFX_IO8
NetR117_2: U22.17(GPIO7) ; port MFX_IO7
NetR119_1: U22.16(GPIO6) ; port MFX_IO6
NetR142_1: U22.28(GPIO15) ; port MFX_IO15
NetR155_1: R155.1 U22.21(USART_TX)
NetR155_2: R155.2 U22.22(USART_RX)
NetR156_1: R156.1 U22.44(BOOT0)
NetR158_1: R158.1 R159.1 U22.45(I2C_ADDR)
NetR163_1: R163.1 R164.2 U22.2(WAKEUP)
NetR163_2: R163.2 ; port MFX_WKUP
NetR287_2: R287.2 U22.42(I2C_SCL)
NetR288_2: R288.2 U22.43(I2C_SDA)
NetR290_2: R290.2 U22.46(IRQOUT)
NetSB15_1: U22.30(GPIO9) ; port MFX_IO9
NetU22_15: U22.15(GPIO5) ; port MFX_IO5

Not connected (* = marked no-connect by the designer): CN21 5; U22 3(IDD_CAL/GPO4) 4(IDD_SH0) 5(IDD_SH1/GPO5) 6(IDD_SH2/GPO6) 10(TSC_XP/GPO0) 11(TSC_XN/GPO1) 12(TSC_YP/GPO2) 13(TSC_YN/GPO3) 25(IDD_MEAS) 38(IDD_SH3/GPO7) 41(IDD_VDD_MCU)

### Notes on the sheet
- MFX
  Multi Function eXpander
- one capacitor close to each MFX pins: VDD, VDD_1, VDD_2, VDD_3
- PI8
- PB8
- PB9
- (near U22) Default I2C Address:1000010
- Title:
- Project:
- Size:
- Date:
- A4
- Reference:
- Sheet:
- Revision:
- of
- (in symbol MFX) MFX_V3

### Library data of the parts
C82 C83 C174 C176 C177 C179 C182 = Cap_100nF_X7R_10%_0402: Capacitor,100nF,16V,X7R,10%,0402,YAGEO; Manuf_Part_1: CC0402KRX7R7BB104; Revision: July-2002: Re-released for DXP Platform.; Value: 100nF; Order: CC0402KRX7R7BB104; Manuf_1: YAGEO
C86 = Cap_1uF_POL_10%_TANA: Polarized Capacitor,1uF,16V,10%,typeA,AVX; Manuf_Part_1: TAJA105K016R; Revision: July-2002: Re-released for DXP Platform.; Value: 1uF; Order: TAJA105K016R; Manuf_1: AVX; Distrib: *
CN21 = Header 3X2: Header, 3-Pin, Dual row; Revision: 17-Jul-2002: Re-released for DXP Platform.; Publisher: Altium Limited
D16 = Diode: Default Diode; Code - JEDEC: DO-214-AB; Published: 8-Jun-2000; Revision: July-2002: Re-released for DXP Platform.; Publisher: Altium Limited
L6 = BEAD_600R_350MA_0603: Bead,600R,350mA,0603,FCM1608KF-601T03,Tai-tech; Manuf_2: TDK; Manuf_Part_2: MPZ1608S300A; Value: 100uH; Comment_1: bead,30R,5A,0603,MPZ1608S300A,TDK; Revision: July-2002: Re-released for DXP Platform.; Manuf_Part_1: FCM1608KF-601T03; Order: FCM1608KF-601T03; Manuf_1: Tai-tech
R154 R287 R288 R290 = Res1: Resistor; Value: 1K; Ordered by: Subcon; Published: 8-Jun-2000; Revision: July-2002: Re-released for DXP Platform.; Publisher: Altium Limited
R155 = res1: Resistor; Value: 1K; Ordered by: Subcon; Published: 8-Jun-2000; Revision: July-2002: Re-released for DXP Platform.; Publisher: Altium Limited
R156 R164 R165 = Resistor_ST: as R140 on sheet ST_LINK_V2-1
R158 = Resistor_ST: as R147 on sheet ST_LINK_V2-1; Value: 10K
R159 R163 = Res1: Resistor; Value: 1K; Published: 8-Jun-2000; Revision: July-2002: Re-released for DXP Platform.; Publisher: Altium Limited
TP15 = TP
U22 = MFX: Multifunction expander